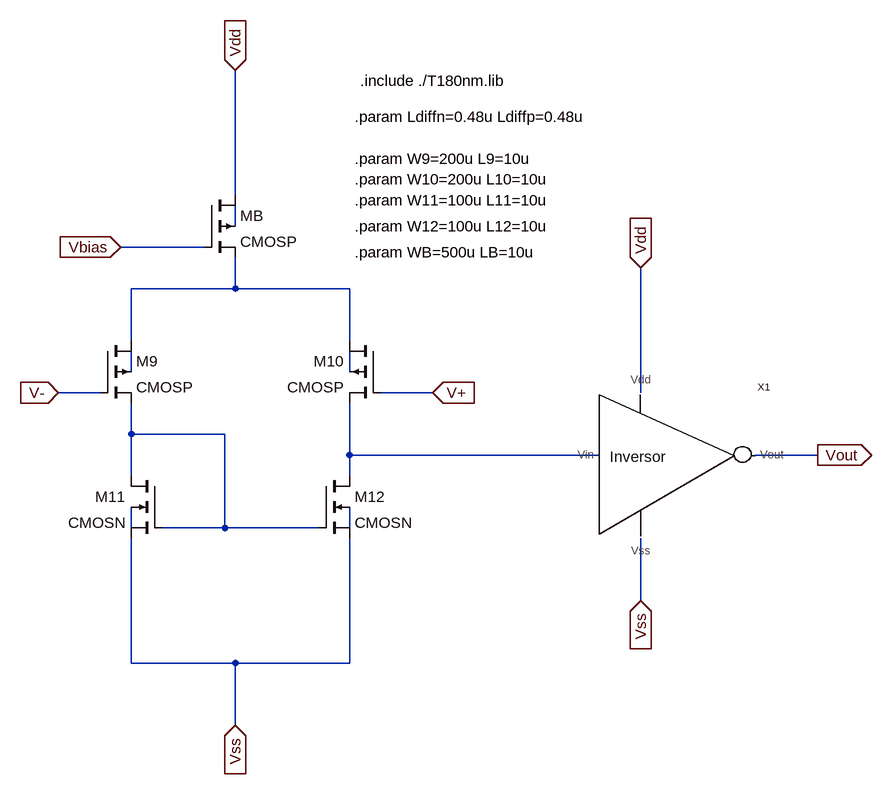
[diagram p0: schematic output_buffer.asc]
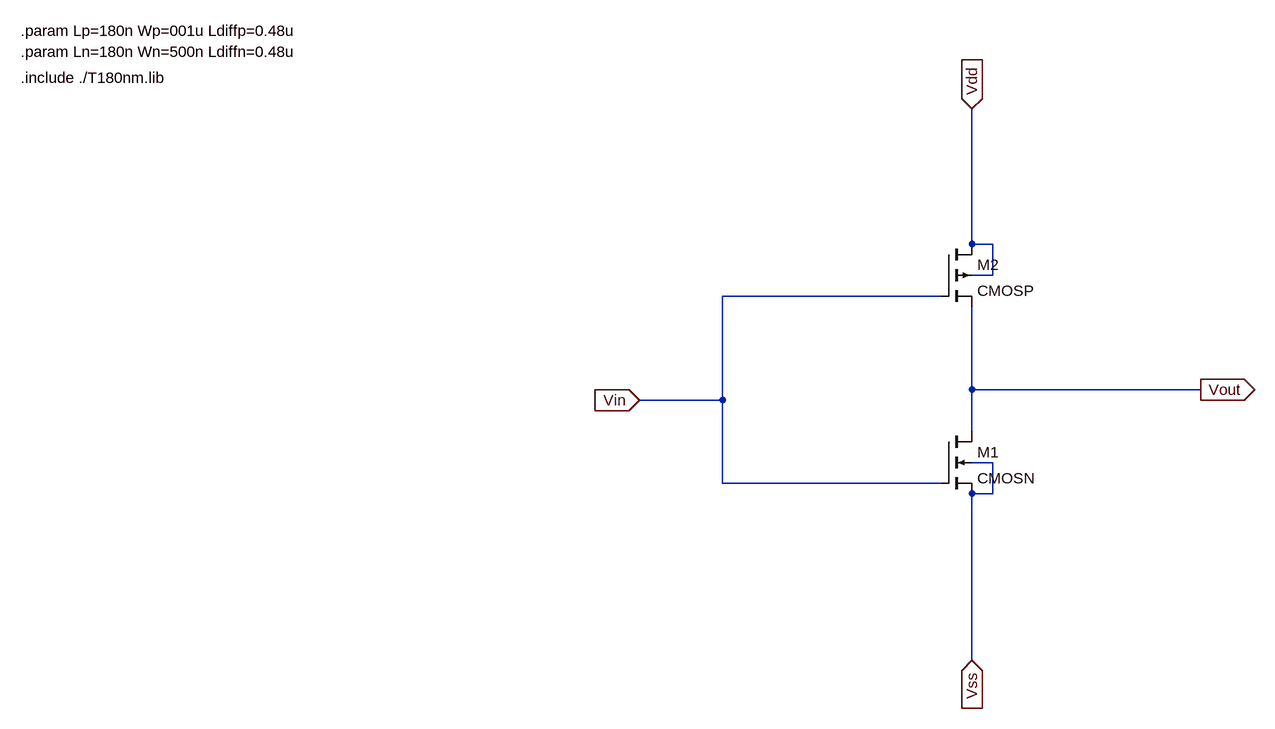
[diagram p1: sub-circuit inversor.asc]
output_buffer.asc, the LTspice schematic file:
Version 4
SHEET 1 1808 1360
WIRE -128 -304 -128 -496
WIRE -128 -256 -128 -288
WIRE -176 -224 -304 -224
WIRE -128 -160 -128 -208
WIRE -128 -160 -288 -160
WIRE 48 -160 -128 -160
WIRE -288 -80 -288 -160
WIRE 48 -80 48 -160
WIRE -288 -32 -288 -64
WIRE 48 -32 48 -64
WIRE -336 0 -400 0
WIRE 176 0 96 0
WIRE 496 0 496 -192
WIRE -288 64 -288 16
WIRE -144 64 -288 64
WIRE 48 96 48 16
WIRE 432 96 48 96
WIRE 768 96 672 96
WIRE -288 128 -288 64
WIRE 48 128 48 96
WIRE -288 208 -288 176
WIRE -144 208 -144 64
WIRE -144 208 -240 208
WIRE 0 208 -144 208
WIRE 48 208 48 176
WIRE 496 320 496 224
WIRE -288 416 -288 224
WIRE -128 416 -288 416
WIRE 48 416 48 224
WIRE 48 416 -128 416
WIRE -128 512 -128 416
FLAG -128 -496 Vdd
IOPIN -128 -496 In
FLAG -304 -224 Vbias
IOPIN -304 -224 In
FLAG -128 512 Vss
IOPIN -128 512 In
FLAG 496 -192 Vdd
IOPIN 496 -192 In
FLAG 496 320 Vss
IOPIN 496 320 In
FLAG 768 96 Vout
IOPIN 768 96 Out
FLAG -400 0 V-
IOPIN -400 0 In
FLAG 176 0 V+
IOPIN 176 0 In
SYMBOL nmos4 -240 128 M0
SYMATTR InstName M11
SYMATTR Value CMOSN
SYMATTR Value2 l={L11} w={W11} ad={Ldiffn*W11} as={Ldiffn*W11} pd={2*Ldiffn+W11} ps={2*Ldiffn+W11}
SYMBOL nmos4 0 128 R0
SYMATTR InstName M12
SYMATTR Value CMOSN
SYMATTR Value2 l={L12} w={W12} ad={Ldiffn*W12} as={Ldiffn*W12} pd={2*Ldiffn+W12} ps={2*Ldiffn+W12}
SYMBOL pmos4 -336 -80 R0
SYMATTR InstName M9
SYMATTR Value CMOSP
SYMATTR Value2 l={L9} w={W9} ad={Ldiffp*W9} as={Ldiffp*W9} pd={2*Ldiffp+W9} ps={2*Ldiffp+W9}
SYMBOL pmos4 -176 -304 R0
SYMATTR InstName MB
SYMATTR Value CMOSP
SYMATTR Value2 l={LB} w={WB} ad={Ldiffp*WB} as={Ldiffp*WB} pd={2*Ldiffp+WB} ps={2*Ldiffp+WB}
SYMBOL pmos4 96 -80 M0
SYMATTR InstName M10
SYMATTR Value CMOSP
SYMATTR Value2 l={L10} w={W10} ad={Ldiffp*W10} as={Ldiffp*W10} pd={2*Ldiffp+W10} ps={2*Ldiffp+W10}
SYMBOL inversor 496 96 R0
SYMATTR InstName X1
TEXT 64 -480 Left 2 !.include ./T180nm.lib
TEXT 56 -424 Left 2 !.param Ldiffn=0.48u Ldiffp=0.48u
TEXT 56 -360 Left 2 !.param W9=200u L9=10u
TEXT 56 -328 Left 2 !.param W10=200u L10=10u
TEXT 56 -296 Left 2 !.param W11=100u L11=10u
TEXT 56 -256 Left 2 !.param W12=100u L12=10u
TEXT 56 -216 Left 2 !.param WB=500u LB=10u

inversor.asc, the sub-circuit schematic file:
Version 4
SHEET 1 880 712
WIRE 224 -96 224 -304
WIRE 256 -96 224 -96
WIRE 256 -48 256 -96
WIRE 256 -48 224 -48
WIRE 176 -16 -160 -16
WIRE 224 128 224 0
WIRE 576 128 224 128
WIRE -160 144 -160 -16
WIRE -160 144 -288 144
WIRE 224 192 224 128
WIRE 256 240 224 240
WIRE -160 272 -160 144
WIRE 176 272 -160 272
WIRE 256 288 256 240
WIRE 256 288 224 288
WIRE 224 544 224 288
FLAG -288 144 Vin
IOPIN -288 144 In
FLAG 576 128 Vout
IOPIN 576 128 Out
FLAG 224 -304 Vdd
IOPIN 224 -304 In
FLAG 224 544 Vss
IOPIN 224 544 In
SYMBOL nmos4 176 192 R0
SYMATTR InstName M1
SYMATTR Value CMOSN
SYMATTR Value2 l={Ln} w={Wn} ad={Ldiffn*Wn} as={Ldiffn*Wn} pd={2*Ldiffn+Wn} ps={2*Ldiffn+Wn}
SYMBOL pmos4 176 -96 R0
SYMATTR InstName M2
SYMATTR Value CMOSP
SYMATTR Value2 l={Lp} w={Wp} ad={Ldiffp*Wp} as={Ldiffp*Wp} pd={2*Ldiffp+Wp} ps={2*Ldiffp+Wp}
TEXT -1240 -352 Left 2 !.include ./T180nm.lib
TEXT -1240 -424 Left 2 !.param Lp=180n Wp=001u Ldiffp=0.48u
TEXT -1240 -392 Left 2 !.param Ln=180n Wn=500n Ldiffn=0.48u

The netlist it stands for:
* output_buffer.asc
M11 N005 N005 Vss N007 CMOSN l={L11} w={W11} ad={Ldiffn*W11} as={Ldiffn*W11} pd={2*Ldiffn+W11} ps={2*Ldiffn+W11}
M12 N006 N005 Vss N008 CMOSN l={L12} w={W12} ad={Ldiffn*W12} as={Ldiffn*W12} pd={2*Ldiffn+W12} ps={2*Ldiffn+W12}
M9 N002 V- N005 N003 CMOSP l={L9} w={W9} ad={Ldiffp*W9} as={Ldiffp*W9} pd={2*Ldiffp+W9} ps={2*Ldiffp+W9}
MB Vdd Vbias N002 N001 CMOSP l={LB} w={WB} ad={Ldiffp*WB} as={Ldiffp*WB} pd={2*Ldiffp+WB} ps={2*Ldiffp+WB}
M10 N002 V+ N006 N004 CMOSP l={L10} w={W10} ad={Ldiffp*W10} as={Ldiffp*W10} pd={2*Ldiffp+W10} ps={2*Ldiffp+W10}
XX1 N006 Vdd Vss Vout inversor

* block symbol definitions
.subckt inversor Vin Vdd Vss Vout
M1 Vout Vin Vss Vss CMOSN l={Ln} w={Wn} ad={Ldiffn*Wn} as={Ldiffn*Wn} pd={2*Ldiffn+Wn} ps={2*Ldiffn+Wn}
M2 Vdd Vin Vout Vdd CMOSP l={Lp} w={Wp} ad={Ldiffp*Wp} as={Ldiffp*Wp} pd={2*Ldiffp+Wp} ps={2*Ldiffp+Wp}
.include ./T180nm.lib
.param Lp=180n Wp=001u Ldiffp=0.48u
.param Ln=180n Wn=500n Ldiffn=0.48u
.ends inversor

.model NMOS NMOS
.model PMOS PMOS
.lib standard.mos
.include ./T180nm.lib
.param Ldiffn=0.48u Ldiffp=0.48u
.param W9=200u L9=10u
.param W10=200u L10=10u
.param W11=100u L11=10u
.param W12=100u L12=10u
.param WB=500u LB=10u
.backanno
.end